# Altium project LimeSDR-QPCIe_1v2.PrjPcb (part 5 of 13)

## Sheet 14_FPGA_banks_7A_8A.SchDoc: FPGA banks 7A, 8A
size A3; Organization: Lime Microsystems; Address1: Surrey Tech Centre; Address2: Guildford GU2 7YG; Address3: Surrey; Address4: United Kingdom; Revision: v1.2; SheetNumber: 12; SheetTotal: 27
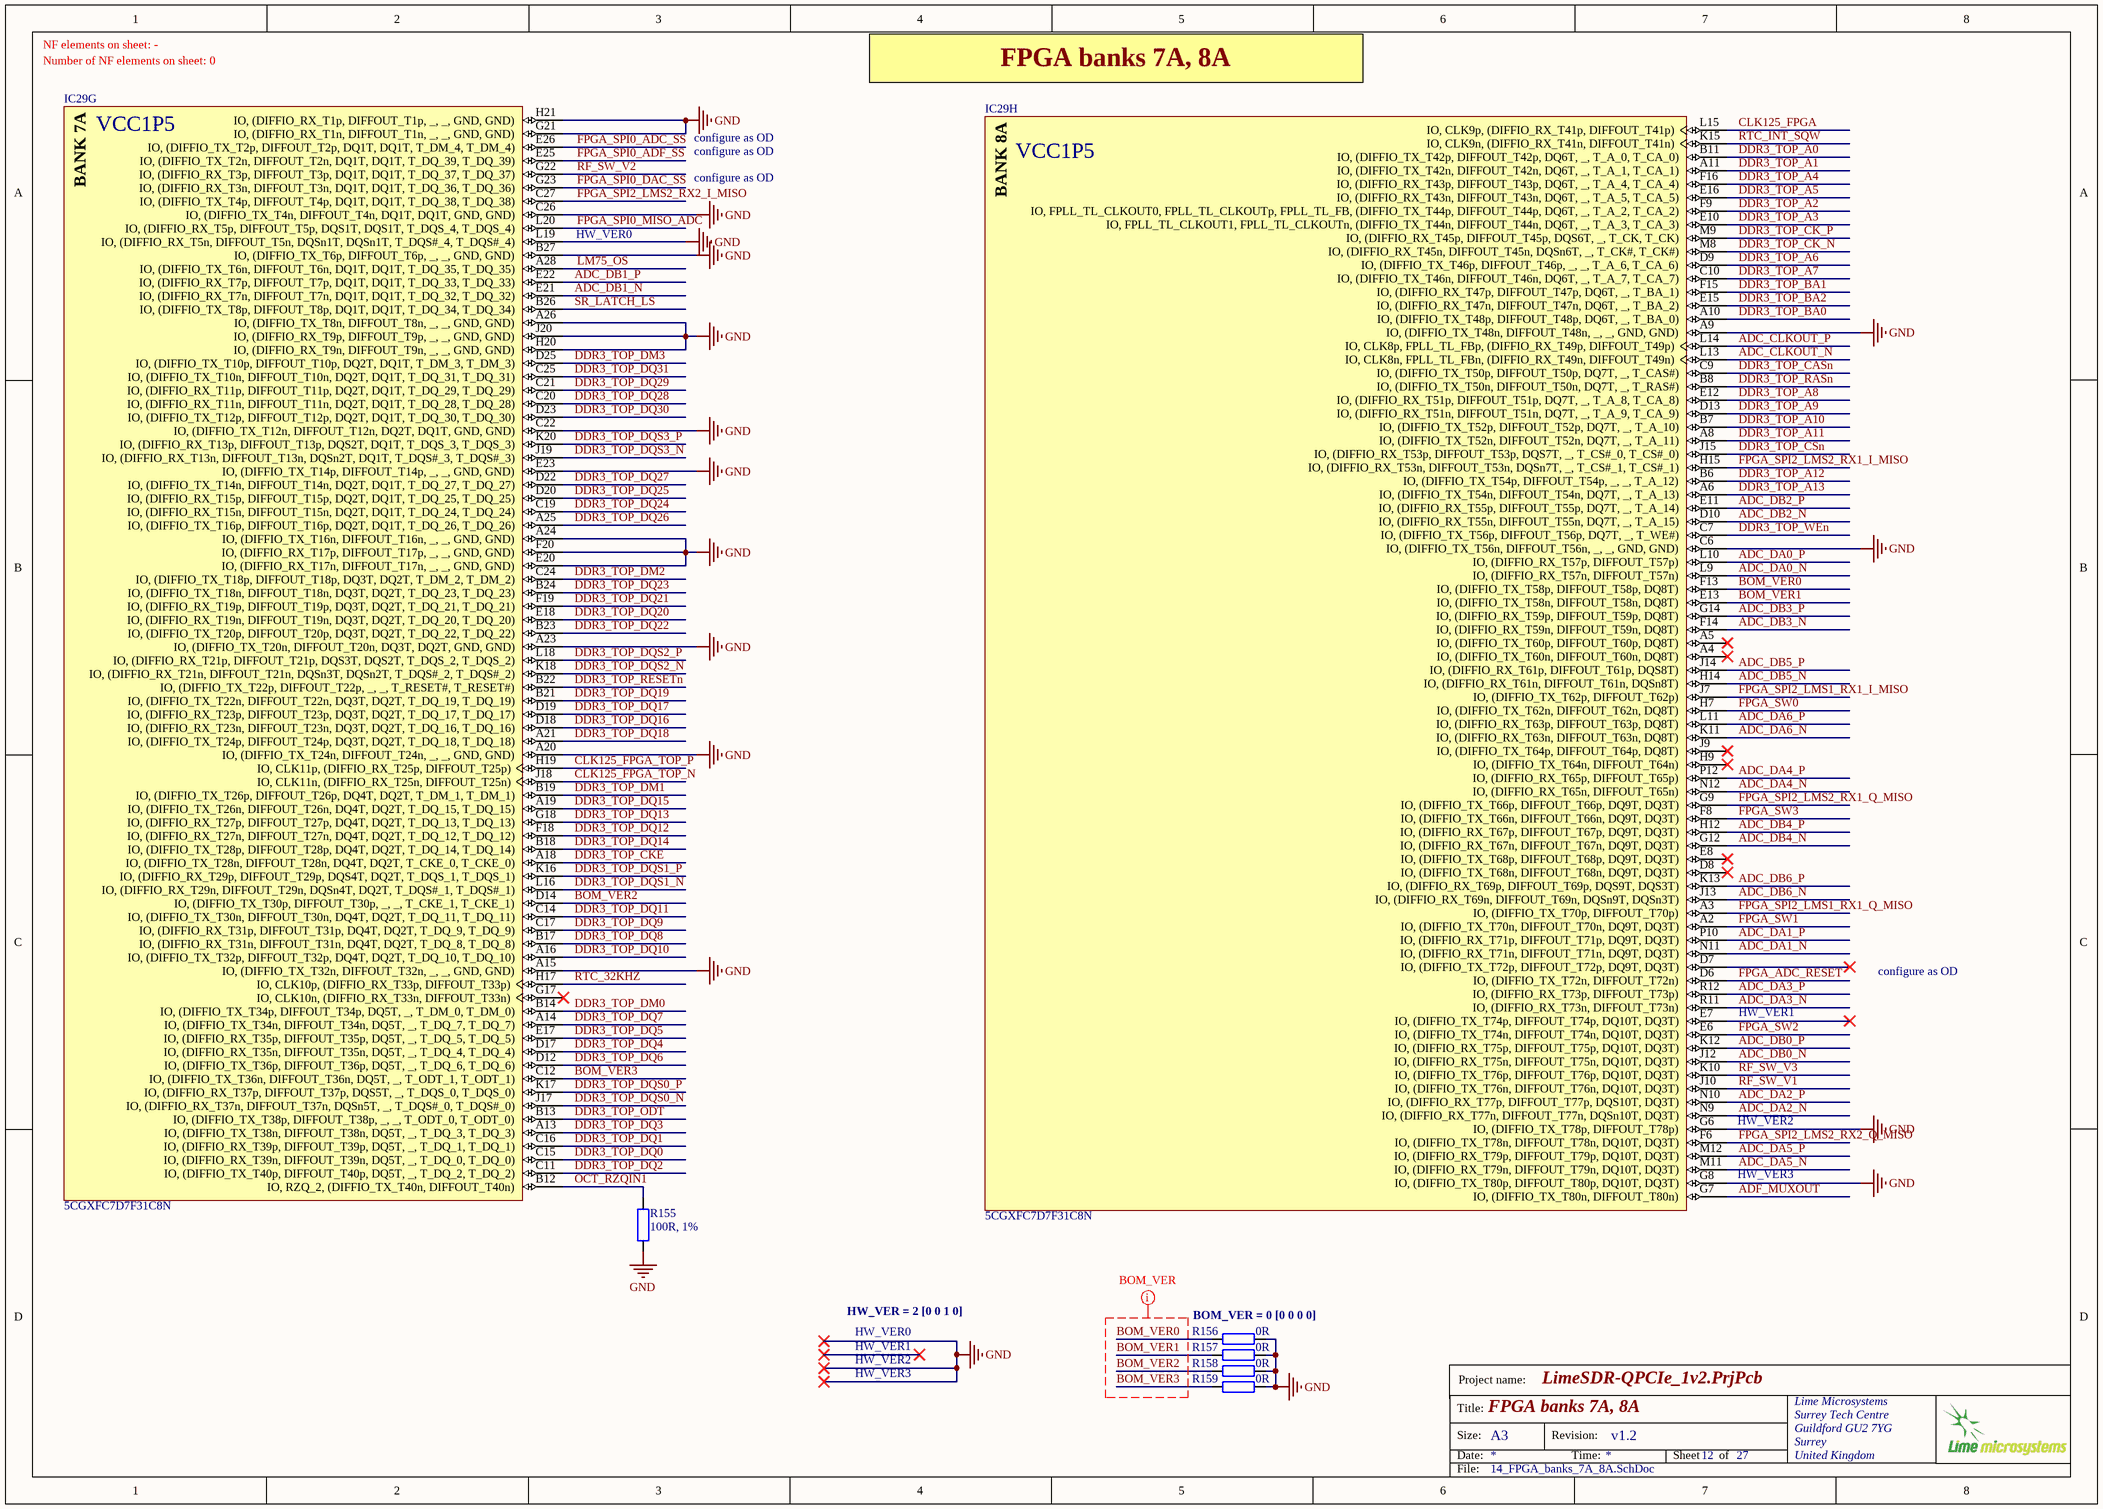
[diagram p13: 14_FPGA_banks_7A_8A.SchDoc]

### Parts
IC29  5CGXFC7D7F31C8N  [ALTR-FBGA896_A-200]  (parts G,H of 16)
R155  100R, 1%  [RES0402]
R156  0R  [RES0402]
R157  0R  [RES0402]
R158  0R  [RES0402]
R159  0R  [RES0402]

### Nets
GND: IC29.A9(IO,_(DIFFIO_TX_T48n,_DIFFOUT_T48n,__,__,_GND,_GND)) IC29.A15(IO,_(DIFFIO_TX_T32n,_DIFFOUT_T32n,__,__,_GND,_GND)) IC29.A20(IO,_(DIFFIO_TX_T24n,_DIFFOUT_T24n,__,__,_GND,_GND)) IC29.A23(IO,_(DIFFIO_TX_T20n,_DIFFOUT_T20n,_DQ3T,_DQ2T,_GND,_GND)) IC29.A24(IO,_(DIFFIO_TX_T16n,_DIFFOUT_T16n,__,__,_GND,_GND)) IC29.A26(IO,_(DIFFIO_TX_T8n,_DIFFOUT_T8n,__,__,_GND,_GND)) IC29.B27(IO,_(DIFFIO_TX_T6p,_DIFFOUT_T6p,__,__,_GND,_GND)) IC29.C6(IO,_(DIFFIO_TX_T56n,_DIFFOUT_T56n,__,__,_GND,_GND)) IC29.C22(IO,_(DIFFIO_TX_T12n,_DIFFOUT_T12n,_DQ2T,_DQ1T,_GND,_GND)) IC29.C26(IO,_(DIFFIO_TX_T4n,_DIFFOUT_T4n,_DQ1T,_DQ1T,_GND,_GND)) IC29.E20(IO,_(DIFFIO_RX_T17n,_DIFFOUT_T17n,__,__,_GND,_GND)) IC29.E23(IO,_(DIFFIO_TX_T14p,_DIFFOUT_T14p,__,__,_GND,_GND)) IC29.F20(IO,_(DIFFIO_RX_T17p,_DIFFOUT_T17p,__,__,_GND,_GND)) IC29.G6(IO,_(DIFFIO_TX_T78p,_DIFFOUT_T78p)) IC29.G8(IO,_(DIFFIO_TX_T80p,_DIFFOUT_T80p,_DQ10T,_DQ3T)) IC29.G21(IO,_(DIFFIO_RX_T1n,_DIFFOUT_T1n,__,__,_GND,_GND)) IC29.H20(IO,_(DIFFIO_RX_T9n,_DIFFOUT_T9n,__,__,_GND,_GND)) IC29.H21(IO,_(DIFFIO_RX_T1p,_DIFFOUT_T1p,__,__,_GND,_GND)) IC29.J20(IO,_(DIFFIO_RX_T9p,_DIFFOUT_T9p,__,__,_GND,_GND)) IC29.L19(IO,_(DIFFIO_RX_T5n,_DIFFOUT_T5n,_DQSn1T,_DQSn1T,_T_DQS#_4,_T_DQS#_4)) R155.1 R156.2 R157.2 R158.2 R159.2
ADC_CLKOUT_N: IC29.L13(IO,_CLK8n,_FPLL_TL_FBn,_(DIFFIO_RX_T49n,_DIFFOUT_T49n))
ADC_CLKOUT_P: IC29.L14(IO,_CLK8p,_FPLL_TL_FBp,_(DIFFIO_RX_T49p,_DIFFOUT_T49p))
ADC_DA0_N: IC29.L9(IO,_(DIFFIO_RX_T57n,_DIFFOUT_T57n))
ADC_DA0_P: IC29.L10(IO,_(DIFFIO_RX_T57p,_DIFFOUT_T57p))
ADC_DA1_N: IC29.N11(IO,_(DIFFIO_RX_T71n,_DIFFOUT_T71n,_DQ9T,_DQ3T))
ADC_DA1_P: IC29.P10(IO,_(DIFFIO_RX_T71p,_DIFFOUT_T71p,_DQ9T,_DQ3T))
ADC_DA2_N: IC29.N9(IO,_(DIFFIO_RX_T77n,_DIFFOUT_T77n,_DQSn10T,_DQ3T))
ADC_DA2_P: IC29.N10(IO,_(DIFFIO_RX_T77p,_DIFFOUT_T77p,_DQS10T,_DQ3T))
ADC_DA3_N: IC29.R11(IO,_(DIFFIO_RX_T73n,_DIFFOUT_T73n))
ADC_DA3_P: IC29.R12(IO,_(DIFFIO_RX_T73p,_DIFFOUT_T73p))
ADC_DA4_N: IC29.N12(IO,_(DIFFIO_RX_T65n,_DIFFOUT_T65n))
ADC_DA4_P: IC29.P12(IO,_(DIFFIO_RX_T65p,_DIFFOUT_T65p))
ADC_DA5_N: IC29.M11(IO,_(DIFFIO_RX_T79n,_DIFFOUT_T79n,_DQ10T,_DQ3T))
ADC_DA5_P: IC29.M12(IO,_(DIFFIO_RX_T79p,_DIFFOUT_T79p,_DQ10T,_DQ3T))
ADC_DA6_N: IC29.K11(IO,_(DIFFIO_RX_T63n,_DIFFOUT_T63n,_DQ8T))
ADC_DA6_P: IC29.L11(IO,_(DIFFIO_RX_T63p,_DIFFOUT_T63p,_DQ8T))
ADC_DB0_N: IC29.J12(IO,_(DIFFIO_RX_T75n,_DIFFOUT_T75n,_DQ10T,_DQ3T))
ADC_DB0_P: IC29.K12(IO,_(DIFFIO_RX_T75p,_DIFFOUT_T75p,_DQ10T,_DQ3T))
ADC_DB1_N: IC29.E21(IO,_(DIFFIO_RX_T7n,_DIFFOUT_T7n,_DQ1T,_DQ1T,_T_DQ_32,_T_DQ_32))
ADC_DB1_P: IC29.E22(IO,_(DIFFIO_RX_T7p,_DIFFOUT_T7p,_DQ1T,_DQ1T,_T_DQ_33,_T_DQ_33))
ADC_DB2_N: IC29.D10(IO,_(DIFFIO_RX_T55n,_DIFFOUT_T55n,_DQ7T,__,_T_A_15))
ADC_DB2_P: IC29.E11(IO,_(DIFFIO_RX_T55p,_DIFFOUT_T55p,_DQ7T,__,_T_A_14))
ADC_DB3_N: IC29.F14(IO,_(DIFFIO_RX_T59n,_DIFFOUT_T59n,_DQ8T))
ADC_DB3_P: IC29.G14(IO,_(DIFFIO_RX_T59p,_DIFFOUT_T59p,_DQ8T))
ADC_DB4_N: IC29.G12(IO,_(DIFFIO_RX_T67n,_DIFFOUT_T67n,_DQ9T,_DQ3T))
ADC_DB4_P: IC29.H12(IO,_(DIFFIO_RX_T67p,_DIFFOUT_T67p,_DQ9T,_DQ3T))
ADC_DB5_N: IC29.H14(IO,_(DIFFIO_RX_T61n,_DIFFOUT_T61n,_DQSn8T))
ADC_DB5_P: IC29.J14(IO,_(DIFFIO_RX_T61p,_DIFFOUT_T61p,_DQS8T))
ADC_DB6_N: IC29.J13(IO,_(DIFFIO_RX_T69n,_DIFFOUT_T69n,_DQSn9T,_DQSn3T))
ADC_DB6_P: IC29.K13(IO,_(DIFFIO_RX_T69p,_DIFFOUT_T69p,_DQS9T,_DQS3T))
ADF_MUXOUT: IC29.G7(IO,_(DIFFIO_TX_T80n,_DIFFOUT_T80n))
BOM_VER0: IC29.F13(IO,_(DIFFIO_TX_T58p,_DIFFOUT_T58p,_DQ8T)) R156.1
BOM_VER1: IC29.E13(IO,_(DIFFIO_TX_T58n,_DIFFOUT_T58n,_DQ8T)) R157.1
BOM_VER2: IC29.D14(IO,_(DIFFIO_TX_T30p,_DIFFOUT_T30p,__,__,_T_CKE_1,_T_CKE_1)) R158.1
BOM_VER3: IC29.C12(IO,_(DIFFIO_TX_T36n,_DIFFOUT_T36n,_DQ5T,__,_T_ODT_1,_T_ODT_1)) R159.1
CLK125_FPGA: IC29.L15(IO,_CLK9p,_(DIFFIO_RX_T41p,_DIFFOUT_T41p))
CLK125_FPGA_TOP_N: IC29.J18(IO,_CLK11n,_(DIFFIO_RX_T25n,_DIFFOUT_T25n))
CLK125_FPGA_TOP_P: IC29.H19(IO,_CLK11p,_(DIFFIO_RX_T25p,_DIFFOUT_T25p))
DDR3_TOP_A0: IC29.B11(IO,_(DIFFIO_TX_T42p,_DIFFOUT_T42p,_DQ6T,__,_T_A_0,_T_CA_0))
DDR3_TOP_A1: IC29.A11(IO,_(DIFFIO_TX_T42n,_DIFFOUT_T42n,_DQ6T,__,_T_A_1,_T_CA_1))
DDR3_TOP_A2: IC29.F9(IO,_FPLL_TL_CLKOUT0,_FPLL_TL_CLKOUTp,_FPLL_TL_FB,_(DIFFIO_TX_T44p,_DIFFOUT_T44p,_DQ6T,__,_T_A_2,_T_CA_2))
DDR3_TOP_A3: IC29.E10(IO,_FPLL_TL_CLKOUT1,_FPLL_TL_CLKOUTn,_(DIFFIO_TX_T44n,_DIFFOUT_T44n,_DQ6T,__,_T_A_3,_T_CA_3))
DDR3_TOP_A4: IC29.F16(IO,_(DIFFIO_RX_T43p,_DIFFOUT_T43p,_DQ6T,__,_T_A_4,_T_CA_4))
DDR3_TOP_A5: IC29.E16(IO,_(DIFFIO_RX_T43n,_DIFFOUT_T43n,_DQ6T,__,_T_A_5,_T_CA_5))
DDR3_TOP_A6: IC29.D9(IO,_(DIFFIO_TX_T46p,_DIFFOUT_T46p,__,__,_T_A_6,_T_CA_6))
DDR3_TOP_A7: IC29.C10(IO,_(DIFFIO_TX_T46n,_DIFFOUT_T46n,_DQ6T,__,_T_A_7,_T_CA_7))
DDR3_TOP_A8: IC29.E12(IO,_(DIFFIO_RX_T51p,_DIFFOUT_T51p,_DQ7T,__,_T_A_8,_T_CA_8))
DDR3_TOP_A9: IC29.D13(IO,_(DIFFIO_RX_T51n,_DIFFOUT_T51n,_DQ7T,__,_T_A_9,_T_CA_9))
DDR3_TOP_A10: IC29.B7(IO,_(DIFFIO_TX_T52p,_DIFFOUT_T52p,_DQ7T,__,_T_A_10))
DDR3_TOP_A11: IC29.A8(IO,_(DIFFIO_TX_T52n,_DIFFOUT_T52n,_DQ7T,__,_T_A_11))
DDR3_TOP_A12: IC29.B6(IO,_(DIFFIO_TX_T54p,_DIFFOUT_T54p,__,__,_T_A_12))
DDR3_TOP_A13: IC29.A6(IO,_(DIFFIO_TX_T54n,_DIFFOUT_T54n,_DQ7T,__,_T_A_13))
DDR3_TOP_BA0: IC29.A10(IO,_(DIFFIO_TX_T48p,_DIFFOUT_T48p,_DQ6T,__,_T_BA_0))
DDR3_TOP_BA1: IC29.F15(IO,_(DIFFIO_RX_T47p,_DIFFOUT_T47p,_DQ6T,__,_T_BA_1))
DDR3_TOP_BA2: IC29.E15(IO,_(DIFFIO_RX_T47n,_DIFFOUT_T47n,_DQ6T,__,_T_BA_2))
DDR3_TOP_CASn: IC29.C9(IO,_(DIFFIO_TX_T50p,_DIFFOUT_T50p,_DQ7T,__,_T_CAS#))
DDR3_TOP_CK_N: IC29.M8(IO,_(DIFFIO_RX_T45n,_DIFFOUT_T45n,_DQSn6T,__,_T_CK#,_T_CK#))
DDR3_TOP_CK_P: IC29.M9(IO,_(DIFFIO_RX_T45p,_DIFFOUT_T45p,_DQS6T,__,_T_CK,_T_CK))
DDR3_TOP_CKE: IC29.A18(IO,_(DIFFIO_TX_T28n,_DIFFOUT_T28n,_DQ4T,_DQ2T,_T_CKE_0,_T_CKE_0))
DDR3_TOP_CSn: IC29.J15(IO,_(DIFFIO_RX_T53p,_DIFFOUT_T53p,_DQS7T,__,_T_CS#_0,_T_CS#_0))
DDR3_TOP_DM0: IC29.B14(IO,_(DIFFIO_TX_T34p,_DIFFOUT_T34p,_DQ5T,__,_T_DM_0,_T_DM_0))
DDR3_TOP_DM1: IC29.B19(IO,_(DIFFIO_TX_T26p,_DIFFOUT_T26p,_DQ4T,_DQ2T,_T_DM_1,_T_DM_1))
DDR3_TOP_DM2: IC29.C24(IO,_(DIFFIO_TX_T18p,_DIFFOUT_T18p,_DQ3T,_DQ2T,_T_DM_2,_T_DM_2))
DDR3_TOP_DM3: IC29.D25(IO,_(DIFFIO_TX_T10p,_DIFFOUT_T10p,_DQ2T,_DQ1T,_T_DM_3,_T_DM_3))
DDR3_TOP_DQ0: IC29.C15(IO,_(DIFFIO_RX_T39n,_DIFFOUT_T39n,_DQ5T,__,_T_DQ_0,_T_DQ_0))
DDR3_TOP_DQ1: IC29.C16(IO,_(DIFFIO_RX_T39p,_DIFFOUT_T39p,_DQ5T,__,_T_DQ_1,_T_DQ_1))
DDR3_TOP_DQ2: IC29.C11(IO,_(DIFFIO_TX_T40p,_DIFFOUT_T40p,_DQ5T,__,_T_DQ_2,_T_DQ_2))
DDR3_TOP_DQ3: IC29.A13(IO,_(DIFFIO_TX_T38n,_DIFFOUT_T38n,_DQ5T,__,_T_DQ_3,_T_DQ_3))
DDR3_TOP_DQ4: IC29.D17(IO,_(DIFFIO_RX_T35n,_DIFFOUT_T35n,_DQ5T,__,_T_DQ_4,_T_DQ_4))
DDR3_TOP_DQ5: IC29.E17(IO,_(DIFFIO_RX_T35p,_DIFFOUT_T35p,_DQ5T,__,_T_DQ_5,_T_DQ_5))
DDR3_TOP_DQ6: IC29.D12(IO,_(DIFFIO_TX_T36p,_DIFFOUT_T36p,_DQ5T,__,_T_DQ_6,_T_DQ_6))
DDR3_TOP_DQ7: IC29.A14(IO,_(DIFFIO_TX_T34n,_DIFFOUT_T34n,_DQ5T,__,_T_DQ_7,_T_DQ_7))
DDR3_TOP_DQ8: IC29.B17(IO,_(DIFFIO_RX_T31n,_DIFFOUT_T31n,_DQ4T,_DQ2T,_T_DQ_8,_T_DQ_8))
DDR3_TOP_DQ9: IC29.C17(IO,_(DIFFIO_RX_T31p,_DIFFOUT_T31p,_DQ4T,_DQ2T,_T_DQ_9,_T_DQ_9))
DDR3_TOP_DQ10: IC29.A16(IO,_(DIFFIO_TX_T32p,_DIFFOUT_T32p,_DQ4T,_DQ2T,_T_DQ_10,_T_DQ_10))
DDR3_TOP_DQ11: IC29.C14(IO,_(DIFFIO_TX_T30n,_DIFFOUT_T30n,_DQ4T,_DQ2T,_T_DQ_11,_T_DQ_11))
DDR3_TOP_DQ12: IC29.F18(IO,_(DIFFIO_RX_T27n,_DIFFOUT_T27n,_DQ4T,_DQ2T,_T_DQ_12,_T_DQ_12))
DDR3_TOP_DQ13: IC29.G18(IO,_(DIFFIO_RX_T27p,_DIFFOUT_T27p,_DQ4T,_DQ2T,_T_DQ_13,_T_DQ_13))
DDR3_TOP_DQ14: IC29.B18(IO,_(DIFFIO_TX_T28p,_DIFFOUT_T28p,_DQ4T,_DQ2T,_T_DQ_14,_T_DQ_14))
DDR3_TOP_DQ15: IC29.A19(IO,_(DIFFIO_TX_T26n,_DIFFOUT_T26n,_DQ4T,_DQ2T,_T_DQ_15,_T_DQ_15))
DDR3_TOP_DQ16: IC29.D18(IO,_(DIFFIO_RX_T23n,_DIFFOUT_T23n,_DQ3T,_DQ2T,_T_DQ_16,_T_DQ_16))
DDR3_TOP_DQ17: IC29.D19(IO,_(DIFFIO_RX_T23p,_DIFFOUT_T23p,_DQ3T,_DQ2T,_T_DQ_17,_T_DQ_17))
DDR3_TOP_DQ18: IC29.A21(IO,_(DIFFIO_TX_T24p,_DIFFOUT_T24p,_DQ3T,_DQ2T,_T_DQ_18,_T_DQ_18))
DDR3_TOP_DQ19: IC29.B21(IO,_(DIFFIO_TX_T22n,_DIFFOUT_T22n,_DQ3T,_DQ2T,_T_DQ_19,_T_DQ_19))
DDR3_TOP_DQ20: IC29.E18(IO,_(DIFFIO_RX_T19n,_DIFFOUT_T19n,_DQ3T,_DQ2T,_T_DQ_20,_T_DQ_20))
DDR3_TOP_DQ21: IC29.F19(IO,_(DIFFIO_RX_T19p,_DIFFOUT_T19p,_DQ3T,_DQ2T,_T_DQ_21,_T_DQ_21))
DDR3_TOP_DQ22: IC29.B23(IO,_(DIFFIO_TX_T20p,_DIFFOUT_T20p,_DQ3T,_DQ2T,_T_DQ_22,_T_DQ_22))
DDR3_TOP_DQ23: IC29.B24(IO,_(DIFFIO_TX_T18n,_DIFFOUT_T18n,_DQ3T,_DQ2T,_T_DQ_23,_T_DQ_23))
DDR3_TOP_DQ24: IC29.C19(IO,_(DIFFIO_RX_T15n,_DIFFOUT_T15n,_DQ2T,_DQ1T,_T_DQ_24,_T_DQ_24))
DDR3_TOP_DQ25: IC29.D20(IO,_(DIFFIO_RX_T15p,_DIFFOUT_T15p,_DQ2T,_DQ1T,_T_DQ_25,_T_DQ_25))
DDR3_TOP_DQ26: IC29.A25(IO,_(DIFFIO_TX_T16p,_DIFFOUT_T16p,_DQ2T,_DQ1T,_T_DQ_26,_T_DQ_26))
DDR3_TOP_DQ27: IC29.D22(IO,_(DIFFIO_TX_T14n,_DIFFOUT_T14n,_DQ2T,_DQ1T,_T_DQ_27,_T_DQ_27))
DDR3_TOP_DQ28: IC29.C20(IO,_(DIFFIO_RX_T11n,_DIFFOUT_T11n,_DQ2T,_DQ1T,_T_DQ_28,_T_DQ_28))
DDR3_TOP_DQ29: IC29.C21(IO,_(DIFFIO_RX_T11p,_DIFFOUT_T11p,_DQ2T,_DQ1T,_T_DQ_29,_T_DQ_29))
DDR3_TOP_DQ30: IC29.D23(IO,_(DIFFIO_TX_T12p,_DIFFOUT_T12p,_DQ2T,_DQ1T,_T_DQ_30,_T_DQ_30))
DDR3_TOP_DQ31: IC29.C25(IO,_(DIFFIO_TX_T10n,_DIFFOUT_T10n,_DQ2T,_DQ1T,_T_DQ_31,_T_DQ_31))
DDR3_TOP_DQS0_N: IC29.J17(IO,_(DIFFIO_RX_T37n,_DIFFOUT_T37n,_DQSn5T,__,_T_DQS#_0,_T_DQS#_0))
DDR3_TOP_DQS0_P: IC29.K17(IO,_(DIFFIO_RX_T37p,_DIFFOUT_T37p,_DQS5T,__,_T_DQS_0,_T_DQS_0))
DDR3_TOP_DQS1_N: IC29.L16(IO,_(DIFFIO_RX_T29n,_DIFFOUT_T29n,_DQSn4T,_DQ2T,_T_DQS#_1,_T_DQS#_1))
DDR3_TOP_DQS1_P: IC29.K16(IO,_(DIFFIO_RX_T29p,_DIFFOUT_T29p,_DQS4T,_DQ2T,_T_DQS_1,_T_DQS_1))
DDR3_TOP_DQS2_N: IC29.K18(IO,_(DIFFIO_RX_T21n,_DIFFOUT_T21n,_DQSn3T,_DQSn2T,_T_DQS#_2,_T_DQS#_2))
DDR3_TOP_DQS2_P: IC29.L18(IO,_(DIFFIO_RX_T21p,_DIFFOUT_T21p,_DQS3T,_DQS2T,_T_DQS_2,_T_DQS_2))
DDR3_TOP_DQS3_N: IC29.J19(IO,_(DIFFIO_RX_T13n,_DIFFOUT_T13n,_DQSn2T,_DQ1T,_T_DQS#_3,_T_DQS#_3))
DDR3_TOP_DQS3_P: IC29.K20(IO,_(DIFFIO_RX_T13p,_DIFFOUT_T13p,_DQS2T,_DQ1T,_T_DQS_3,_T_DQS_3))
DDR3_TOP_ODT: IC29.B13(IO,_(DIFFIO_TX_T38p,_DIFFOUT_T38p,__,__,_T_ODT_0,_T_ODT_0))
DDR3_TOP_RASn: IC29.B8(IO,_(DIFFIO_TX_T50n,_DIFFOUT_T50n,_DQ7T,__,_T_RAS#))
DDR3_TOP_RESETn: IC29.B22(IO,_(DIFFIO_TX_T22p,_DIFFOUT_T22p,__,__,_T_RESET#,_T_RESET#))
DDR3_TOP_WEn: IC29.C7(IO,_(DIFFIO_TX_T56p,_DIFFOUT_T56p,_DQ7T,__,_T_WE#))
FPGA_ADC_RESET: IC29.D6(IO,_(DIFFIO_TX_T72n,_DIFFOUT_T72n))
FPGA_SPI0_ADC_SS: IC29.E26(IO,_(DIFFIO_TX_T2p,_DIFFOUT_T2p,_DQ1T,_DQ1T,_T_DM_4,_T_DM_4))
FPGA_SPI0_ADF_SS: IC29.E25(IO,_(DIFFIO_TX_T2n,_DIFFOUT_T2n,_DQ1T,_DQ1T,_T_DQ_39,_T_DQ_39))
FPGA_SPI0_DAC_SS: IC29.G23(IO,_(DIFFIO_RX_T3n,_DIFFOUT_T3n,_DQ1T,_DQ1T,_T_DQ_36,_T_DQ_36))
FPGA_SPI0_MISO_ADC: IC29.L20(IO,_(DIFFIO_RX_T5p,_DIFFOUT_T5p,_DQS1T,_DQS1T,_T_DQS_4,_T_DQS_4))
FPGA_SPI2_LMS1_RX1_I_MISO: IC29.J7(IO,_(DIFFIO_TX_T62p,_DIFFOUT_T62p))
FPGA_SPI2_LMS1_RX1_Q_MISO: IC29.A3(IO,_(DIFFIO_TX_T70p,_DIFFOUT_T70p))
FPGA_SPI2_LMS2_RX1_I_MISO: IC29.H15(IO,_(DIFFIO_RX_T53n,_DIFFOUT_T53n,_DQSn7T,__,_T_CS#_1,_T_CS#_1))
FPGA_SPI2_LMS2_RX1_Q_MISO: IC29.G9(IO,_(DIFFIO_TX_T66p,_DIFFOUT_T66p,_DQ9T,_DQ3T))
FPGA_SPI2_LMS2_RX2_I_MISO: IC29.C27(IO,_(DIFFIO_TX_T4p,_DIFFOUT_T4p,_DQ1T,_DQ1T,_T_DQ_38,_T_DQ_38))
FPGA_SPI2_LMS2_RX2_Q_MISO: IC29.F6(IO,_(DIFFIO_TX_T78n,_DIFFOUT_T78n,_DQ10T,_DQ3T))
FPGA_SW0: IC29.H7(IO,_(DIFFIO_TX_T62n,_DIFFOUT_T62n,_DQ8T))
FPGA_SW1: IC29.A2(IO,_(DIFFIO_TX_T70n,_DIFFOUT_T70n,_DQ9T,_DQ3T))
FPGA_SW2: IC29.E6(IO,_(DIFFIO_TX_T74n,_DIFFOUT_T74n,_DQ10T,_DQ3T))
FPGA_SW3: IC29.F8(IO,_(DIFFIO_TX_T66n,_DIFFOUT_T66n,_DQ9T,_DQ3T))
LM75_OS: IC29.A28(IO,_(DIFFIO_TX_T6n,_DIFFOUT_T6n,_DQ1T,_DQ1T,_T_DQ_35,_T_DQ_35))
OCT_RZQIN1: IC29.B12(IO,_RZQ_2,_(DIFFIO_TX_T40n,_DIFFOUT_T40n)) R155.2
RF_SW_V1: IC29.J10(IO,_(DIFFIO_TX_T76n,_DIFFOUT_T76n,_DQ10T,_DQ3T))
RF_SW_V2: IC29.G22(IO,_(DIFFIO_RX_T3p,_DIFFOUT_T3p,_DQ1T,_DQ1T,_T_DQ_37,_T_DQ_37))
RF_SW_V3: IC29.K10(IO,_(DIFFIO_TX_T76p,_DIFFOUT_T76p,_DQ10T,_DQ3T))
RTC_32KHZ: IC29.H17(IO,_CLK10p,_(DIFFIO_RX_T33p,_DIFFOUT_T33p))
RTC_INT_SQW: IC29.K15(IO,_CLK9n,_(DIFFIO_RX_T41n,_DIFFOUT_T41n))
SR_LATCH_LS: IC29.B26(IO,_(DIFFIO_TX_T8p,_DIFFOUT_T8p,_DQ1T,_DQ1T,_T_DQ_34,_T_DQ_34))

Not connected (* = marked no-connect by the designer): IC29 A4(IO,_(DIFFIO_TX_T60n,_DIFFOUT_T60n,_DQ8T))* A5(IO,_(DIFFIO_TX_T60p,_DIFFOUT_T60p,_DQ8T))* D7(IO,_(DIFFIO_TX_T72p,_DIFFOUT_T72p,_DQ9T,_DQ3T))* D8(IO,_(DIFFIO_TX_T68n,_DIFFOUT_T68n,_DQ9T,_DQ3T))* E7(IO,_(DIFFIO_TX_T74p,_DIFFOUT_T74p,_DQ10T,_DQ3T))* E8(IO,_(DIFFIO_TX_T68p,_DIFFOUT_T68p,_DQ9T,_DQ3T))* G17(IO,_CLK10n,_(DIFFIO_RX_T33n,_DIFFOUT_T33n))* H9(IO,_(DIFFIO_TX_T64n,_DIFFOUT_T64n))* J9(IO,_(DIFFIO_TX_T64p,_DIFFOUT_T64p,_DQ8T))*

### Layout directives
net class BOM_VER: BOM_VER0, BOM_VER1, BOM_VER2, BOM_VER3

### Notes on the sheet
- NF elements on sheet: -
- Number of NF elements on sheet: 0
- FPGA banks 7A, 8A
- VCC1P5
- configure as OD
- (near IC29) HW_VER0
- (near IC29) HW_VER1
- (near IC29) HW_VER2
- (near IC29) HW_VER3
- HW_VER = 2 [0 0 1 0]
- (near R156) BOM_VER = 0 [0 0 0 0]
- HW_VER0
- HW_VER1
- HW_VER2
- HW_VER3
- Project name:
- Title:
- Size:
- Date:
- A3
- Revision:
- Time:
- Sheet
- of
- File:
- (in symbol 5CGXFC7D7F31C8N, part G) BANK 7A
- (in symbol 5CGXFC7D7F31C8N, part H) BANK 8A

### Library data of the parts
IC29 = 5CGXFC7D7F31C8N: as IC29 on sheet 12_FPGA_banks_3A_3B_4A; DatasheetVersion: Rev. 3.4; PackageVersion: Rev. 2.0, 12/2012; PackageReference: FBGA896_A-200; PackageDescription: 896-Pin FineLine Ball-Grid Array (FBGA), Body 31 x 31 mm, Pitch 1 mm; Supplier 1: Digi-Key; Supplier Part Number 1: 544-2772-ND; Supplier 2: Mouser; Supplier Part Number 2: 989-5CGXFC7D7F31C8N; Device Group: 5CGXFC7; RoHS: RoHS Compliant; Subcategory: Cyclone V GX; Voltage Supply: 1.07 to 1.13 V; NexusDeviceID: 5CGXFC7D7F31C8N; Mounting Technology: Surface Mount; Code_JEDEC: MS-034-AAN-1; PartNumber: 5CGXFC7D7F31C8N; ComponentLink1Description: Manufacturer URL; ComponentLink1URL: http://www.altera.com; ComponentLink2Description: Datasheet; ComponentLink2URL: http://www.altera.com/literature/hb/cyclone-v/cv_51002.pdf; ComponentLink3Description: Package Specification; ComponentLink3URL: http://www.altera.com/devicepackaging/04R00435-01.pdf; ComponentLink4Description: Device Handbook URL; ComponentLink4URL: http://www.altera.com/literature/hb/cyclone-v/cyclone5_handbook.pdf; ComponentLink5Description: Device Pin-Out URL; ComponentLink5URL: http://www.altera.com/literature/dp/cyclone-v/5CGXFC7.xls; ComponentLink6Description: Device Overview URL; ComponentLink6URL: http://www.altera.com/literature/hb/cyclone-v/cv_51001.pdf; ComponentLink7Description: Product URL; ComponentLink7URL: http://www.buyaltera.com/scripts/partsearch.dll?Detail&name=5CGXFC7D7F31C8N-ND
R155 = Res_0402: Manufacturer Part Number 1: RMCF0402FT100R; Part Description: RES SMD 100 OHM 1% 1/16W 0402; Manufacturer: Stackpole Electronics Inc.; Temperature Coefficient: ±100ppm/°C; Supplier 1: Digi-Key; Supplier Part Number 1: RMCF0402FT100RDKR-ND; Package / Case: 0402 (1005 Metric); Composition: Thick Film; Category: Resistors; Tolerance: ±1%; Value: 100R, 1%
R156-R159 = Res_0402: Manufacturer: Yageo; Part Description: RES SMD 0.0OHM JUMPER 1/16W 0402; Manufacturer Part Number 1: RC0402JR-070RL; Supplier 1: Digi-Key; Supplier Part Number 1: 311-0.0JRTR-ND; Composition: Thick Film; Package / Case: 0402 (1005 Metric); Category: Resistors; Value: 0R

## Sheet 15_FPGA_misc_banks.SchDoc: FPGA misc
size A3; Organization: Lime Microsystems; Address1: Surrey Tech Centre; Address2: Guildford GU2 7YG; Address3: Surrey; Address4: United Kingdom; Revision: v1.2; SheetNumber: 13; SheetTotal: 27
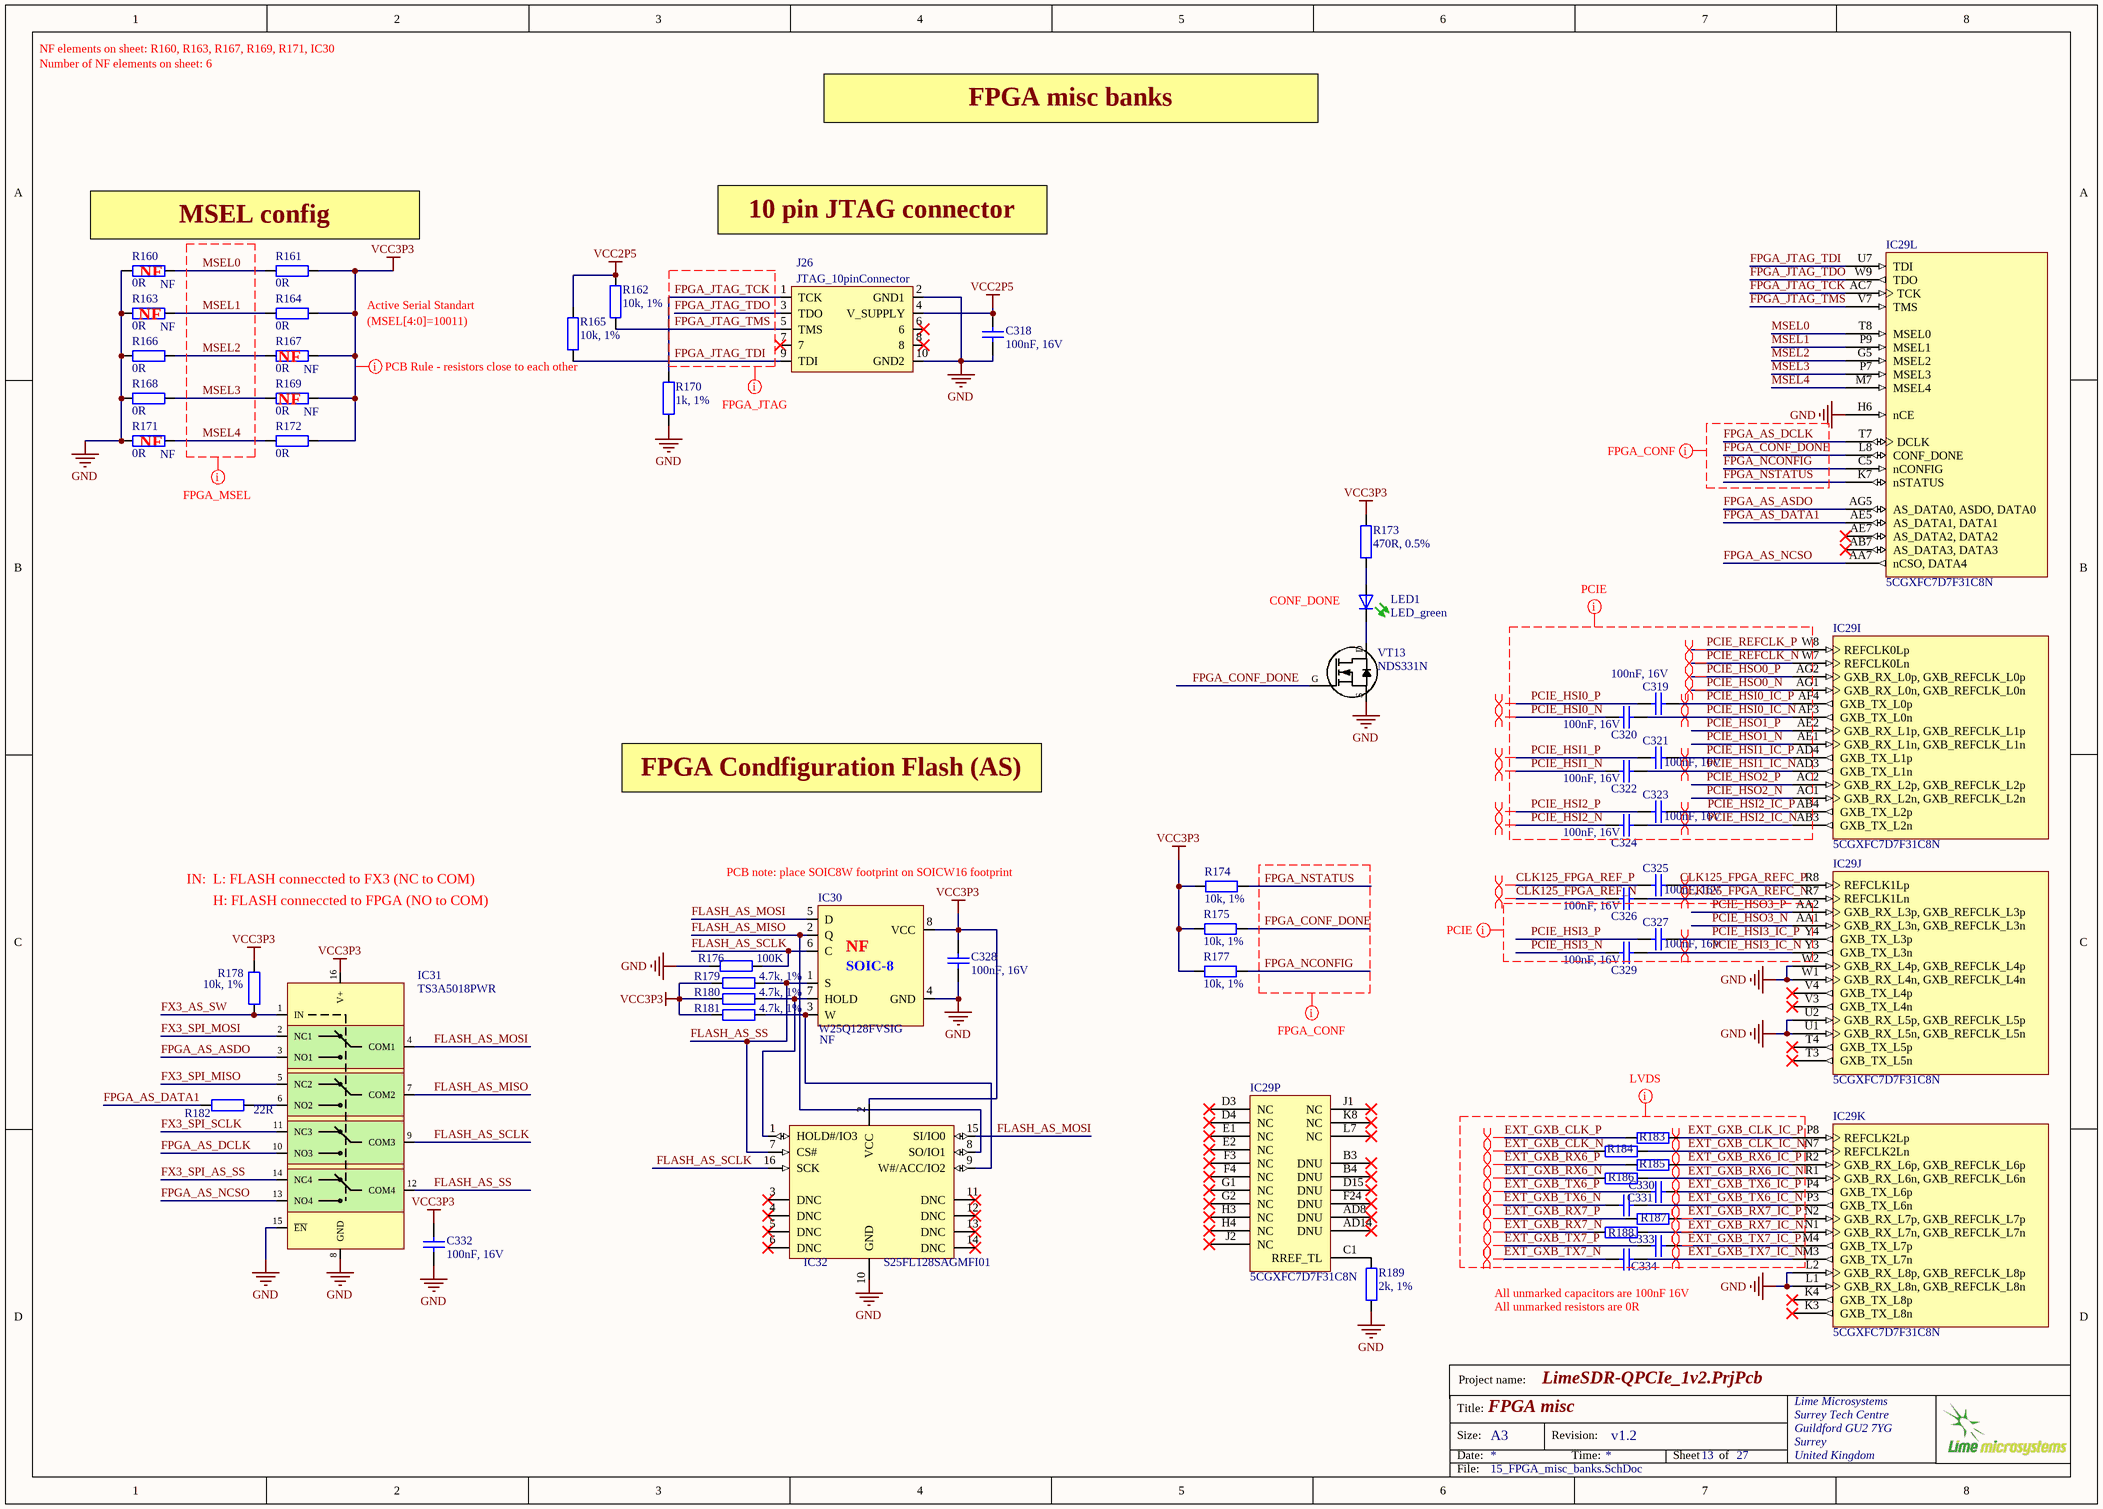
[diagram p14: 15_FPGA_misc_banks.SchDoc]

### Parts
C318  100nF, 16V  [CAP0402]
C319  100nF, 16V  [CAP0402]
C320  100nF, 16V  [CAP0402]
C321  100nF, 16V  [CAP0402]
C322  100nF, 16V  [CAP0402]
C323  100nF, 16V  [CAP0402]
C324  100nF, 16V  [CAP0402]
C325  100nF, 16V  [CAP0402]
C326  100nF, 16V  [CAP0402]
C327  100nF, 16V  [CAP0402]
C328  100nF, 16V  [CAP0402]
C329  100nF, 16V  [CAP0402]
C330  100nF, 16V  [CAP0402]  (value not drawn)
C331  100nF, 16V  [CAP0402]  (value not drawn)
C332  100nF, 16V  [CAP0402]
C333  100nF, 16V  [CAP0402]  (value not drawn)
C334  100nF, 16V  [CAP0402]  (value not drawn)
IC29  5CGXFC7D7F31C8N  [ALTR-FBGA896_A-200]  (parts I,J,K,L,P of 16)
IC30  W25Q128FVSIG  Assembly Info: NF  [S25FL164K_WSO8N]
IC31  TS3A5018PWR  [TS3A5018PWR]
IC32  S25FL128SAGMFI01  [SOIC16_WIDE]
J26  JTAG_10pinConnector  [HEADER5x2_SM]
LED1  LED_green  [LED-0603-GREEN]
R160  0R  Assembly Info: NF  [RES0402]
R161  0R  [RES0402]
R162  10k, 1%  [RES0402]
R163  0R  Assembly Info: NF  [RES0402]
R164  0R  [RES0402]
R165  10k, 1%  [RES0402]
R166  0R  [RES0402]
R167  0R  Assembly Info: NF  [RES0402]
R168  0R  [RES0402]
R169  0R  Assembly Info: NF  [RES0402]
R170  1k, 1%  [RES0402]
R171  0R  Assembly Info: NF  [RES0402]
R172  0R  [RES0402]
R173  470R, 0.5%  [RES0402]
R174  10k, 1%  [RES0402]
R175  10k, 1%  [RES0402]
R176  100K  [RES0402]
R177  10k, 1%  [RES0402]
R178  10k, 1%  [RES0402]
R179  4.7k, 1%  [RES0402]
R180  4.7k, 1%  [RES0402]
R181  4.7k, 1%  [RES0402]
R182  22R  [RES0402]
R183  0R  [RES0402]  (value not drawn)
R184  0R  [RES0402]  (value not drawn)
R185  0R  [RES0402]  (value not drawn)
R186  0R  [RES0402]  (value not drawn)
R187  0R  [RES0402]  (value not drawn)
R188  0R  [RES0402]  (value not drawn)
R189  2k, 1%  [RES0402]
VT13  NDS331N  [SOT23-3]

### Nets
GND: C318.2 C328.2 C332.2 IC29.H6(nCE) IC29.L1(GXB_RX_L8n,_GXB_REFCLK_L8n) IC29.L2(GXB_RX_L8p,_GXB_REFCLK_L8p) IC29.U1(GXB_RX_L5n,_GXB_REFCLK_L5n) IC29.U2(GXB_RX_L5p,_GXB_REFCLK_L5p) IC29.W1(GXB_RX_L4n,_GXB_REFCLK_L4n) IC29.W2(GXB_RX_L4p,_GXB_REFCLK_L4p) IC30.4(GND) IC31.8(GND) IC31.15(~{EN}) IC32.10(GND) J26.2(GND1) J26.10(GND2) R160.2 R163.2 R166.2 R168.2 R170.2 R171.2 R176.2 R189.2 VT13.S
VCC2P5: C318.1 J26.4(V_SUPPLY) R162.1 R165.1
VCC3P3: C328.1 C332.1 IC30.8(VCC) IC31.16(V+) IC32.2(VCC) R161.1 R164.1 R167.1 R169.1 R172.1 R173.2 R174.1 R175.1 R177.1 R178.2 R179.2 R180.2 R181.2
CLK125_FPGA_REF_N: C326.2
CLK125_FPGA_REF_P: C325.2
CLK125_FPGA_REFC_N: C326.1 IC29.R7(REFCLK1Ln)
CLK125_FPGA_REFC_P: C325.1 IC29.R8(REFCLK1Lp)
EXT_GXB_CLK_IC_N: IC29.N7(REFCLK2Ln) R184.1
EXT_GXB_CLK_IC_P: IC29.P8(REFCLK2Lp) R183.1
EXT_GXB_CLK_N: R184.2
EXT_GXB_CLK_P: R183.2
EXT_GXB_RX6_IC_N: IC29.R1(GXB_RX_L6n,_GXB_REFCLK_L6n) R186.1
EXT_GXB_RX6_IC_P: IC29.R2(GXB_RX_L6p,_GXB_REFCLK_L6p) R185.1
EXT_GXB_RX6_N: R186.2
EXT_GXB_RX6_P: R185.2
EXT_GXB_RX7_IC_N: IC29.N1(GXB_RX_L7n,_GXB_REFCLK_L7n) R188.1
EXT_GXB_RX7_IC_P: IC29.N2(GXB_RX_L7p,_GXB_REFCLK_L7p) R187.1
EXT_GXB_RX7_N: R188.2
EXT_GXB_RX7_P: R187.2
EXT_GXB_TX6_IC_N: C331.1 IC29.P3(GXB_TX_L6n)
EXT_GXB_TX6_IC_P: C330.1 IC29.P4(GXB_TX_L6p)
EXT_GXB_TX6_N: C331.2
EXT_GXB_TX6_P: C330.2
EXT_GXB_TX7_IC_N: C334.1 IC29.M3(GXB_TX_L7n)
EXT_GXB_TX7_IC_P: C333.1 IC29.M4(GXB_TX_L7p)
EXT_GXB_TX7_N: C334.2
EXT_GXB_TX7_P: C333.2
FLASH_AS_MISO: IC30.2(Q) IC31.7(COM2) IC32.8(SO/IO1)
FLASH_AS_MOSI: IC30.5(D) IC31.4(COM1) IC32.15(SI/IO0)
FLASH_AS_SCLK: IC30.6(C) IC31.9(COM3) IC32.16(SCK) R176.1
FLASH_AS_SS: IC30.1(S) IC31.12(COM4) IC32.7(CS#) R179.1
FPGA_AS_ASDO: IC29.AG5(AS_DATA0,_ASDO,_DATA0) IC31.3(NO1)
FPGA_AS_DATA1: IC29.AE5(AS_DATA1,_DATA1) R182.2
FPGA_AS_DCLK: IC29.T7(DCLK) IC31.10(NO3)
FPGA_AS_NCSO: IC29.AA7(nCSO,_DATA4) IC31.13(NO4)
FPGA_CONF_DONE: IC29.L8(CONF_DONE) R175.2 VT13.G
FPGA_JTAG_TCK: IC29.AC7(TCK) J26.1(TCK) R170.1
FPGA_JTAG_TDI: IC29.U7(TDI) J26.9(TDI) R165.2
FPGA_JTAG_TDO: IC29.W9(TDO) J26.3(TDO)
FPGA_JTAG_TMS: IC29.V7(TMS) J26.5(TMS) R162.2
FPGA_NCONFIG: IC29.C5(nCONFIG) R177.2
FPGA_NSTATUS: IC29.K7(nSTATUS) R174.2
FX3_AS_SW: IC31.1(IN) R178.1
FX3_SPI_AS_SS: IC31.14(NC4)
FX3_SPI_MISO: IC31.5(NC2)
FX3_SPI_MOSI: IC31.2(NC1)
FX3_SPI_SCLK: IC31.11(NC3)
MSEL0: IC29.T8(MSEL0) R160.1 R161.2
MSEL1: IC29.P9(MSEL1) R163.1 R164.2
MSEL2: IC29.G5(MSEL2) R166.1 R167.2
MSEL3: IC29.P7(MSEL3) R168.1 R169.2
MSEL4: IC29.M7(MSEL4) R171.1 R172.2
PCIE_HSI0_IC_N: C320.1 IC29.AF3(GXB_TX_L0n)
PCIE_HSI0_IC_P: C319.1 IC29.AF4(GXB_TX_L0p)
PCIE_HSI0_N: C320.2
PCIE_HSI0_P: C319.2
PCIE_HSI1_IC_N: C322.1 IC29.AD3(GXB_TX_L1n)
PCIE_HSI1_IC_P: C321.1 IC29.AD4(GXB_TX_L1p)
PCIE_HSI1_N: C322.2
PCIE_HSI1_P: C321.2
PCIE_HSI2_IC_N: C324.1 IC29.AB3(GXB_TX_L2n)
PCIE_HSI2_IC_P: C323.1 IC29.AB4(GXB_TX_L2p)
PCIE_HSI2_N: C324.2
PCIE_HSI2_P: C323.2
PCIE_HSI3_IC_N: C329.1 IC29.Y3(GXB_TX_L3n)
PCIE_HSI3_IC_P: C327.1 IC29.Y4(GXB_TX_L3p)
PCIE_HSI3_N: C329.2
PCIE_HSI3_P: C327.2
PCIE_HSO0_N: IC29.AG1(GXB_RX_L0n,_GXB_REFCLK_L0n)
PCIE_HSO0_P: IC29.AG2(GXB_RX_L0p,_GXB_REFCLK_L0p)
PCIE_HSO1_N: IC29.AE1(GXB_RX_L1n,_GXB_REFCLK_L1n)
PCIE_HSO1_P: IC29.AE2(GXB_RX_L1p,_GXB_REFCLK_L1p)
PCIE_HSO2_N: IC29.AC1(GXB_RX_L2n,_GXB_REFCLK_L2n)
PCIE_HSO2_P: IC29.AC2(GXB_RX_L2p,_GXB_REFCLK_L2p)
PCIE_HSO3_N: IC29.AA1(GXB_RX_L3n,_GXB_REFCLK_L3n)
PCIE_HSO3_P: IC29.AA2(GXB_RX_L3p,_GXB_REFCLK_L3p)
PCIE_REFCLK_N: IC29.W7(REFCLK0Ln)
PCIE_REFCLK_P: IC29.W8(REFCLK0Lp)
NetIC29_C1: IC29.C1(RREF_TL) R189.1
NetIC30_3: IC30.3(W) IC32.9(W#/ACC/IO2) R181.1
NetIC30_7: IC30.7(HOLD) IC32.1(HOLD#/IO3) R180.1
NetIC31_6: IC31.6(NO2) R182.1
NetLED1_A: LED1.A R173.1
NetLED1_K: LED1.K(C) VT13.D

Not connected (* = marked no-connect by the designer): IC29 AB7(AS_DATA3,_DATA3)* AD8(DNU)* AD14(DNU)* AE7(AS_DATA2,_DATA2)* B3(DNU)* B4(DNU)* D3(NC)* D4(NC)* D15(DNU)* E1(NC)* E2(NC)* F3(NC)* F4(NC)* F24(DNU)* G1(NC)* G2(NC)* H3(NC)* H4(NC)* J1(NC)* J2(NC)* K3(GXB_TX_L8n)* K4(GXB_TX_L8p)* K8(NC)* L7(NC)* T3(GXB_TX_L5n)* T4(GXB_TX_L5p)* V3(GXB_TX_L4n)* V4(GXB_TX_L4p)*; IC32 3(DNC)* 4(DNC)* 5(DNC)* 6(DNC)* 11(DNC)* 12(DNC)* 13(DNC)* 14(DNC)*; J26 6* 7* 8*

### Layout directives
net class FPGA_CONF: FPGA_AS_DCLK, FPGA_CONF_DONE, FPGA_NCONFIG, FPGA_NSTATUS
differential pair: CLK125_FPGA_REF_N, CLK125_FPGA_REF_P, CLK125_FPGA_REFC_N, CLK125_FPGA_REFC_P, EXT_GXB_CLK_IC_N, EXT_GXB_CLK_IC_P, EXT_GXB_CLK_N, EXT_GXB_CLK_P, EXT_GXB_RX6_IC_N, EXT_GXB_RX6_IC_P, EXT_GXB_RX6_N, EXT_GXB_RX6_P, EXT_GXB_RX7_IC_N, EXT_GXB_RX7_IC_P, EXT_GXB_RX7_N, EXT_GXB_RX7_P, EXT_GXB_TX6_IC_N, EXT_GXB_TX6_IC_P, EXT_GXB_TX6_N, EXT_GXB_TX6_P, EXT_GXB_TX7_IC_N, EXT_GXB_TX7_IC_P, EXT_GXB_TX7_N, EXT_GXB_TX7_P, PCIE_HSI0_IC_N, PCIE_HSI0_IC_P, PCIE_HSI0_N, PCIE_HSI0_P, PCIE_HSI1_IC_N, PCIE_HSI1_IC_P, PCIE_HSI1_N, PCIE_HSI1_P, PCIE_HSI2_IC_N, PCIE_HSI2_IC_P, PCIE_HSI2_N, PCIE_HSI2_P, PCIE_HSI3_IC_N, PCIE_HSI3_IC_P, PCIE_HSO0_N, PCIE_HSO0_P, PCIE_REFCLK_N, PCIE_REFCLK_P
rule Undefined: VCC3P3
net class FPGA_MSEL: MSEL0, MSEL1, MSEL2, MSEL3, MSEL4
net class PCIE: PCIE_HSI0_IC_N, PCIE_HSI0_IC_P, PCIE_HSI0_N, PCIE_HSI0_P, PCIE_HSI1_IC_N, PCIE_HSI1_IC_P, PCIE_HSI1_N, PCIE_HSI1_P, PCIE_HSI2_IC_N, PCIE_HSI2_IC_P, PCIE_HSI2_N, PCIE_HSI2_P, PCIE_HSI3_IC_N, PCIE_HSI3_IC_P, PCIE_HSI3_N, PCIE_HSI3_P, PCIE_HSO0_N, PCIE_HSO0_P, PCIE_HSO1_N, PCIE_HSO1_P, PCIE_HSO2_N, PCIE_HSO2_P, PCIE_HSO3_N, PCIE_HSO3_P, PCIE_REFCLK_N, PCIE_REFCLK_P
net class FPGA_JTAG: FPGA_JTAG_TCK, FPGA_JTAG_TDI, FPGA_JTAG_TDO, FPGA_JTAG_TMS
net class LVDS: EXT_GXB_CLK_IC_N, EXT_GXB_CLK_IC_P, EXT_GXB_CLK_N, EXT_GXB_CLK_P, EXT_GXB_RX6_IC_N, EXT_GXB_RX6_IC_P, EXT_GXB_RX6_N, EXT_GXB_RX6_P, EXT_GXB_RX7_IC_N, EXT_GXB_RX7_IC_P, EXT_GXB_RX7_N, EXT_GXB_RX7_P, EXT_GXB_TX6_IC_N, EXT_GXB_TX6_IC_P, EXT_GXB_TX6_N, EXT_GXB_TX6_P, EXT_GXB_TX7_IC_N, EXT_GXB_TX7_IC_P, EXT_GXB_TX7_N, EXT_GXB_TX7_P

### Notes on the sheet
- NF elements on sheet: R160, R163, R167, R169, R171, IC30
- Number of NF elements on sheet: 6
- FPGA misc banks
- MSEL config
- 10 pin JTAG connector
- (near R160) NF
- Active Serial Standart
- (near R163) NF
- (near R167) NF
- (MSEL[4:0]=10011)
- (near R171) NF
- (near R169) NF
- CONF_DONE
- FPGA Condfiguration Flash (AS)
- IN:
- H: FLASH conneccted to FPGA (NO to COM)
- L: FLASH conneccted to FX3 (NC to COM)
- (near IC30) PCB note: place SOIC8W footprint on SOICW16 footprint
- (near IC30) NF
- All unmarked capacitors are 100nF 16V
- All unmarked resistors are 0R
- Project name:
- Title:
- Size:
- Date:
- A3
- Revision:
- Time:
- Sheet
- of
- File:
- (in symbol M25P40) SOIC-8

### Library data of the parts
C318-C327 C329-C331 C333 C334 = Cap_0603: Part Description: 0.10µF ±10% 16V Ceramic Capacitor X7R 0402 (1005 Metric); Manufacturer Part Number 1: GRM155R71C104KA88D; Brand: Murata Electronics; Tolerance: 10 %; Type: General Purpose MLCC; Capacitance: 0.1 uF; Temperature Coefficient / Code: +/- 15 %; Case Height: 0.5 mm; Case Length: 1 mm; Dielectric: X7R; Supplier 1: Mouser; Supplier Part Number 1: 81-GRM155R71C104KA88; Case Code - in: 0402; Manufacturer: Murata Electronics; Category: Multilayer Ceramic Capacitors MLCC - SMD/SMT; Voltage Rating DC: 16 V; Value: 100nF, 16V; Case Code - mm: 1005; Case Width: 0.5 mm; Manufacturer Part Number: GRM155R71C104KA88D; Maximum Operating Temperature: + 125 C; Minimum Operating Temperature: - 55 C; Minimum Order Quantity: 1; Operating Temperature Range: - 55 C to + 125 C; Package / Case: 0402 (1005 metric); Packaging: Reel; Product: General Type MLCCs; Product Category: Low & Medium Capacitance SMD Ceramic Chip Capacitors; Reeling: True; RoHS - Mouser: Y; RoHS: RoHS Compliant; Series: GRM; Standard Pack Qty: 10000; Termination Style: SMD/SMT
C328 C332 = Cap_0603: Manufacturer Part Number 1: GRM155R71C104KA88D; Part Description: 0.10µF ±10% 16V Ceramic Capacitor X7R 0402 (1005 Metric); Brand: Murata Electronics; Tolerance: 10 %; Type: General Purpose MLCC; Capacitance: 0.1 uF; Temperature Coefficient / Code: +/- 15 %; Case Height: 0.5 mm; Case Length: 1 mm; Dielectric: X7R; Supplier 1: Mouser; Supplier Part Number 1: 81-GRM155R71C104KA88; Case Code - in: 0402; Manufacturer: Murata Electronics; Category: Multilayer Ceramic Capacitors MLCC - SMD/SMT; Voltage Rating DC: 16 V; Value: 100nF, 16V; Manufacturer Part Number: GRM155R71C104KA88D; Case Code - mm: 1005; Case Width: 0.5 mm; Maximum Operating Temperature: + 125 C; Minimum Operating Temperature: - 55 C; Minimum Order Quantity: 1; Operating Temperature Range: - 55 C to + 125 C; Package / Case: 0402 (1005 metric); Packaging: Reel; Product: General Type MLCCs; Product Category: Low & Medium Capacitance SMD Ceramic Chip Capacitors; Reeling: True; RoHS - Mouser: Y; RoHS: RoHS Compliant; Series: GRM; Standard Pack Qty: 10000; Termination Style: SMD/SMT
IC29 = 5CGXFC7D7F31C8N: Cyclone V GX Family FPGA, 1.07 to 1.13 V Supply, 480 I/O Pins, 7 PLLs, 896-Pin FBGA, Speed Grade 8, Commercial Grade, RoHS Compliant; Manufacturer: Altera; Part Description: IC FPGA 480 I/O 896FBGA; GPIO: 480; Logic Elements (LE) (K): 149.5; Speed Grade: 8; DatasheetVersion: Rev. 3.4; PackageVersion: Rev. 2.0, 12/2012; PackageReference: FBGA896_A-200; PackageDescription: 896-Pin FineLine Ball-Grid Array (FBGA), Body 31 x 31 mm, Pitch 1 mm; Supplier 1: Digi-Key; Supplier Part Number 1: 544-2772-ND; Supplier 2: Mouser; Supplier Part Number 2: 989-5CGXFC7D7F31C8N; Device Group: 5CGXFC7; RoHS: RoHS Compliant; Subcategory: Cyclone V GX; Voltage Supply: 1.07 to 1.13 V; NexusDeviceID: 5CGXFC7D7F31C8N; Mounting Technology: Surface Mount; Code_JEDEC: MS-034-AAN-1; PartNumber: 5CGXFC7D7F31C8N; ComponentLink1Description: Manufacturer URL; ComponentLink1URL: http://www.altera.com; ComponentLink2Description: Datasheet; ComponentLink2URL: http://www.altera.com/literature/hb/cyclone-v/cv_51002.pdf; ComponentLink3Description: Package Specification; ComponentLink3URL: http://www.altera.com/devicepackaging/04R00435-01.pdf; ComponentLink4Description: Device Handbook URL; ComponentLink4URL: http://www.altera.com/literature/hb/cyclone-v/cyclone5_handbook.pdf; ComponentLink5Description: Device Pin-Out URL; ComponentLink5URL: http://www.altera.com/literature/dp/cyclone-v/5CGXFC7.xls; ComponentLink6Description: Device Overview URL; ComponentLink6URL: http://www.altera.com/literature/hb/cyclone-v/cv_51001.pdf; ComponentLink7Description: Product URL; ComponentLink7URL: http://www.buyaltera.com/scripts/partsearch.dll?Detail&name=5CGXFC7D7F31C8N-ND
IC30 = M25P40: Manufacturer: Winbond Electronics; Part Description: IC FLASH 128MBIT 104MHZ 8SOIC; Interface: SPI Serial; Speed: 104MHz; Memory Size: 128M (16M x 8); Voltage - Supply: 2.7 V ~ 3.6 V; Memory Type: FLASH; Supplier 1: Digi-Key; Supplier Part Number 1: W25Q128FVSIG-ND; Package / Case: 8-SOIC (0.209", 5.30mm Width); Supplier Device Package: 8-SOIC; Manufacturer Part Number 1: W25Q128FVSIG; Operating Temperature: -40°C ~ 85°C; RoHS: RoHS Compliant; Packaging: Tube; Format - Memory: FLASH; Category: Integrated Circuits (ICs)
IC31 = TS3A5018PWR: Manufacturer: Texas Instruments; Part Description: 4 Circuit IC Switch 2:1 10 Ohm 16-TSSOP; Switch Circuit: SPDT; Multiplexer/Demultiplexer Circuit: 2:1; Number of Circuits: 4; On-State Resistance (Max): 10 Ohm; Channel-to-Channel Matching (&Delta;Ron): 300 mOhm; Voltage - Supply, Single (V+): 1.65 V ~ 3.6 V; Switch Time (Ton, Toff) (Max): 8ns, 6.5ns; -3db Bandwidth: 300MHz; Charge Injection: 2pC; Channel Capacitance (CS(off), CD(off)): 4.5pF, 9pF; Current - Leakage (IS(off)) (Max): 100nA; Crosstalk: -48dB @ 10MHz; Supplier 1: Digi-Key; Supplier Part Number 1: 296-17612-1-ND; Manufacturer Part Number 1: TS3A5018PWR; RoHS: RoHS Compliant; Category: Integrated Circuits (ICs); Stock 1: 4598; Pricing 1: 1=0.79, 10=0.694, 100=0.5304, 500=0.42024, 1000=0.3366 (USD); Packaging: Cut Tape (CT); Part Status: Active; Voltage - Supply, Dual (V±): -; Operating Temperature: -40°C ~ 85°C (TA); Package / Case: 16-TSSOP (0.173", 4.40mm Width); Supplier Device Package: 16-TSSOP; ComponentLink1URL: http://www.ti.com/lit/ds/symlink/ts3a5018.pdf; ComponentLink1Description: http://www.ti.com/lit/ds/symlink/ts3a5018.pdf
IC32 = S25FL032P: Manufacturer Part Number: S25FL128SAGMFI010; Manufacturer: Spansion; Part Description: IC FLASH 128MBIT 133MHZ 16SO; Interface: SPI Serial; Speed: 133MHz; Memory Size: 128M (16M x 8); Memory Type: FLASH - NOR; Voltage - Supply: 2.7 V ~ 3.6 V; Format - Memory: FLASH; Supplier Device Package: 16-SO; Package / Case: 16-SOIC (0.295", 7.50mm Width); Packaging: Tray; Operating Temperature: -40°C ~ 85°C; RoHS: RoHS Compliant; Supplier 1: Digi-Key; Supplier Part Number 1: 1274-1140-ND; Category: Integrated Circuits (ICs)
J26 = JTAG_connector_10pin: Manufacturer Part Number 1: 54202-G0805LF; Part Description: 10 Positions Header, Unshrouded Connector 0.100" (2.54mm) Surface Mount Gold or Gold, GXT; Manufacturer: Amphenol FCI; Connector Type: Header, Unshrouded; Number of Positions: 10; Number of Positions Loaded: All; Supplier 1: Digi-Key; Supplier Part Number 1: 609-4723-ND; Contact Type: Male Pin; Category: Connectors, Interconnects; Contact Finish: Gold or Gold, GXT™; Color: Black; Number of Rows: 2; Mounting Type: Surface Mount
LED1 = LED_green: Part Description: Green 572nm LED Indication - Discrete 2.2V 0603 (1608 Metric); Manufacturer Part Number 1: HSMG-C190; Manufacturer: Avago Technologies US Inc.; Current - Test: 20mA; Voltage - Forward (Vf) (Typ): 2.2V; Color: Green; Supplier 1: Digi-Key; Supplier Part Number 1: 516-1425-2-ND; Category: Optoelectronics; Package / Case: 0603 (1608 Metric)
R160 R161 R163 R164 R166-R169 R171 R172 = Res_0402: Manufacturer: Yageo; Part Description: RES SMD 0.0OHM JUMPER 1/16W 0402; Manufacturer Part Number 1: RC0402JR-070RL; Supplier 1: Digi-Key; Supplier Part Number 1: 311-0.0JRTR-ND; Composition: Thick Film; Package / Case: 0402 (1005 Metric); Category: Resistors; Value: 0R
R162 R165 R174 R175 R177 R178 = Res_0402: Manufacturer: Yageo; Manufacturer Part Number 1: RC0402FR-0710KL; Part Description: RES SMD 10K OHM 1% 1/16W 0402; Temperature Coefficient: ±100ppm/°C; Power (Watts): 0.063W, 1/16W; Value: 10k, 1%; Supplier 1: Digi-Key; Supplier Part Number 1: 311-10.0KLRTR-ND; Resistance (Ohms): 10k; Packaging: Tape & Reel (TR); RoHS: RoHS Compliant; Package / Case: 0402 (1005 Metric); Tolerance: ±1%; Operating Temperature: -55°C ~ 155°C; Size / Dimension: 0.039" L x 0.020" W (1.00mm x 0.50mm); Number of Terminations: 2; Category: Resistors; Height: 0.016" (0.40mm); Supplier Device Package: 0402; Features: Moisture Resistant; Composition: Thick Film
R170 = Res_0402: Manufacturer: Stackpole Electronics Inc; Manufacturer Part Number 1: RMCF0402FT1K00; Part Description: RES SMD 1K OHM 1% 1/16W 0402; Temperature Coefficient: ±100ppm/°C; Power (Watts): 0.063W, 1/16W; Value: 1k, 1%; Supplier 1: Digi-Key; Supplier Part Number 1: RMCF0402FT1K00TR-ND; Package / Case: 0402 (1005 Metric); Supplier Device Package: 0402; Height: 0.016" (0.40mm); Size / Dimension: 0.039" L x 0.020" W (1.00mm x 0.50mm); Number of Terminations: 2; Packaging: Cut Tape (CT); Category: Resistors; Composition: Thick Film; Resistance (Ohms): 1k; Tolerance: ±1%; Features: Moisture Resistant; Operating Temperature: -55°C ~ 155°C; RoHS: RoHS Compliant
R173 = Res_0402: Part Description: RES SMD 470 OHM 0.5% 1/16W 0402; Manufacturer Part Number 1: ERA-2AED471X; Manufacturer: Panasonic Electronic Components; Temperature Coefficient: ±25ppm/°C; Supplier 1: Digi-Key; Supplier Part Number 1: P470DETR-ND; Category: Resistors; Number of Terminations: 2; Composition: Thin Film; Tolerance: ±0.5%; value: 470R, 0.5%
R176 = Res_0402: Manufacturer Part Number 1: ERJ-2GEJ104X; Manufacturer: Panasonic Electronic Components; Part Description: RES SMD 100K OHM 5% 1/10W 0402; Tolerance: ±5%; Temperature Coefficient: ±200ppm/°C; Power (Watts): 0.1W, 1/10W; Supplier 1: Digi-Key; Supplier Part Number 1: P100KJCT-ND; Resistance (Ohms): 100k; Composition: Thick Film; Features: Automotive AEC-Q200; Number of Terminations: 2; Height: 0.016" (0.40mm); RoHS: RoHS Compliant; Package / Case: 0402 (1005 Metric); Packaging: Cut Tape (CT); Size / Dimension: 0.039" L x 0.020" W (1.00mm x 0.50mm); Supplier Device Package: 0402; Operating Temperature: -55°C ~ 155°C; Category: Resistors; value: 100K
R179-R181 = Res_0402: Manufacturer: Yageo; Part Description: RES SMD 4.7K OHM 1% 1/16W 0402; Manufacturer Part Number1: RC0402FR-074K7L; Temperature Coefficient: ±100ppm/°C; Power (Watts): 0.063W, 1/16W; Number of Terminations: 2; Category: Resistors; Supplier 1: Digi-Key; Height: 0.016" (0.40mm); Features: Moisture Resistant; Size / Dimension: 0.039" L x 0.020" W (1.00mm x 0.50mm); Supplier Device Package: 0402; RoHS: RoHS Compliant; Composition: Thick Film; Package / Case: 0402 (1005 Metric); Resistance (Ohms): 4.7k; Operating Temperature: -55°C ~ 155°C; Tolerance: ±1%; Supplier Part Number 1: 311-4.7KLRCT-ND; Packaging: Cut Tape (CT); Value: 4.7k, 1%
R182 = Res_0402: Part Description: RES SMD 22 OHM 1% 1/16W 0402; Manufacturer Part Number 1: RC0402FR-0722RL; Manufacturer: Yageo; Tolerance: ±1%; Temperature Coefficient: ±100ppm/°C; Resistance (Ohms): 22; Supplier 1: Digi-Key; Supplier Part Number 1: 311-22.0LRTR-ND; Supplier Device Package: 0402; Composition: Thick Film; Category: Resistors; Value: 22R
R183-R188 = Res_0402: Manufacturer Part Number 1: RC0402JR-070RL; Manufacturer: Yageo; Part Description: RES SMD 0.0OHM JUMPER 1/16W 0402; Resistance (Ohms): 0.0; Tolerance: Jumper; Power (Watts): 0.063W, 1/16W; Value: 0R; Supplier 1: Digi-Key; Supplier Part Number 1: 311-0.0JRTR-ND; Category: Resistors; Temperature Coefficient: -; Features: Moisture Resistant; Supplier Device Package: 0402; Height: 0.016" (0.40mm); Package / Case: 0402 (1005 Metric); Operating Temperature: -55°C ~ 155°C; Size / Dimension: 0.039" L x 0.020" W (1.00mm x 0.50mm); Composition: Thick Film; Packaging: Tape & Reel (TR); Number of Terminations: 2; RoHS: RoHS Compliant
R189 = Res_0402: Manufacturer: Yageo; Part Description: RES SMD 2K OHM 1% 1/16W 0402; Manufacturer Part Number 1: RC0402FR-072KL; Power (Watts): 0.063W, 1/16W; Temperature Coefficient: ±100ppm/°C; Packaging: Cut Tape (CT); Size / Dimension: 0.039" L x 0.020" W (1.00mm x 0.50mm); Operating Temperature: -55°C ~ 155°C; Resistance (Ohms): 2k; Number of Terminations: 2; Supplier Device Package: 0402; Tolerance: ±1%; Features: Moisture Resistant; Category: Resistors; Height: 0.016" (0.40mm); Composition: Thick Film; Supplier 1: Digi-Key; Supplier Part Number 1: 311-2KLRCT-ND; Package / Case: 0402 (1005 Metric); RoHS: RoHS Compliant; Value: 2k, 1%
VT13 = NDS331N: Part Description: MOSFET N-CH 20V 1.3A SSOT3; Manufacturer: Fairchild Semiconductor; Gate Charge (Qg) @ Vgs: 5nC @ 4.5V; Power - Max: 460mW; Current - Continuous Drain (Id) @ 25°C: 1.3A (Ta); Input Capacitance (Ciss) @ Vds: 162pF @ 10V; FET Type: MOSFET N-Channel, Metal Oxide; Drain to Source Voltage (Vdss): 20V; FET Feature: Logic Level Gate; Supplier Device Package: 3-SSOT; Category: Discrete Semiconductor Products; Mounting Type: Surface Mount; Package / Case: TO-236-3, SC-59, SOT-23-3; Supplier 1: Digi-Key; Supplier Part Number 1: NDS331NCT-ND; Manufacturer Part Number: NDS331N; Manufacturer Part Number 1: NDS331N